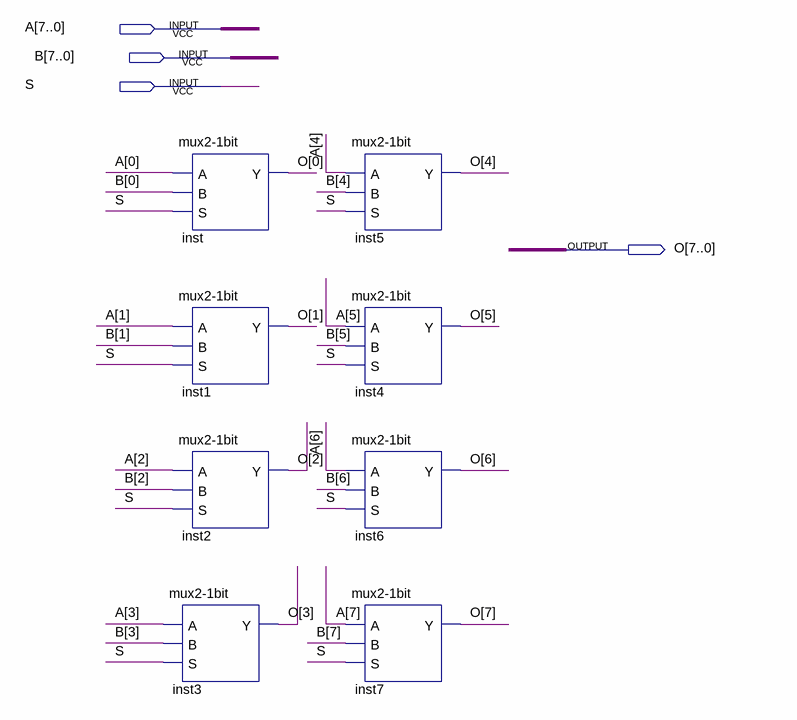
[diagram p0: schematic sheet]
// Quartus schematic MUX2_1_8BITS.bdf as structural Verilog: 8 symbols, 4 pins
module MUX2_1_8BITS (
  input  [7:0] A,
  input  [7:0] B,
  input  S,
  output [7:0] O
);

  \mux2-1bit  inst (.A(A[0]), .B(B[0]), .S(S), .Y(O[0]));
  \mux2-1bit  inst1 (.A(A[1]), .B(B[1]), .S(S), .Y(O[1]));
  \mux2-1bit  inst2 (.A(A[2]), .B(B[2]), .S(S), .Y(O[2]));
  \mux2-1bit  inst3 (.A(A[3]), .B(B[3]), .S(S), .Y(O[3]));
  \mux2-1bit  inst5 (.A(A[4]), .B(B[4]), .S(S), .Y(O[4]));
  \mux2-1bit  inst4 (.A(A[5]), .B(B[5]), .S(S), .Y(O[5]));
  \mux2-1bit  inst6 (.A(A[6]), .B(B[6]), .S(S), .Y(O[6]));
  \mux2-1bit  inst7 (.A(A[7]), .B(B[7]), .S(S), .Y(O[7]));
endmodule
